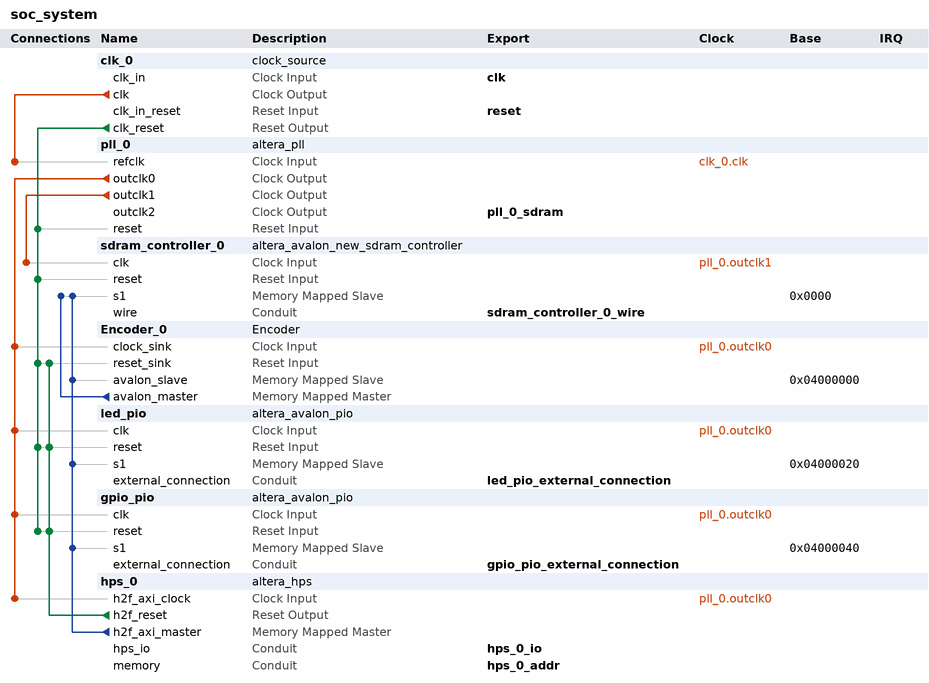
[diagram p0: system contents]
# Platform Designer (Qsys) system soc_system, Cyclone V 5CSEMA5F31C6
# Parameters at their usual value, and those the tool derives, are not listed.
package require -exact qsys 18.1
create_system soc_system
set_project_property DEVICE_FAMILY {Cyclone V}
set_project_property DEVICE 5CSEMA5F31C6

add_instance clk_0 clock_source 18.1
set_instance_parameter_value clk_0 clockFrequency 50000000

add_instance pll_0 altera_pll 18.1
set_instance_parameter_value pll_0 gui_device_speed_grade 1
set_instance_parameter_value pll_0 gui_number_of_clocks 3
set_instance_parameter_value pll_0 gui_operation_mode normal
set_instance_parameter_value pll_0 gui_output_clock_frequency0 50.0
set_instance_parameter_value pll_0 gui_output_clock_frequency1 100.0
set_instance_parameter_value pll_0 gui_output_clock_frequency2 100.0
set_instance_parameter_value pll_0 gui_phase_shift2 -3750
set_instance_parameter_value pll_0 gui_pll_mode {Integer-N PLL}
set_instance_parameter_value pll_0 gui_reference_clock_frequency 50.0
set_instance_parameter_value pll_0 gui_use_locked false

add_instance sdram_controller_0 altera_avalon_new_sdram_controller 18.1
set_instance_parameter_value sdram_controller_0 TAC 5.4
set_instance_parameter_value sdram_controller_0 TRCD 15.0
set_instance_parameter_value sdram_controller_0 TRP 15.0
set_instance_parameter_value sdram_controller_0 casLatency 3
set_instance_parameter_value sdram_controller_0 columnWidth 10
set_instance_parameter_value sdram_controller_0 dataWidth 16
set_instance_parameter_value sdram_controller_0 generateSimulationModel false
set_instance_parameter_value sdram_controller_0 model single_Micron_MT48LC4M32B2_7_chip
set_instance_parameter_value sdram_controller_0 numberOfBanks 4
set_instance_parameter_value sdram_controller_0 numberOfChipSelects 1
set_instance_parameter_value sdram_controller_0 powerUpDelay 100.0
set_instance_parameter_value sdram_controller_0 refreshPeriod 7.8125
set_instance_parameter_value sdram_controller_0 rowWidth 13

add_instance Encoder_0 Encoder 1.0

add_instance led_pio altera_avalon_pio 18.1
set_instance_parameter_value led_pio bitModifyingOutReg true
set_instance_parameter_value led_pio direction Output
set_instance_parameter_value led_pio width 10

add_instance gpio_pio altera_avalon_pio 18.1
set_instance_parameter_value gpio_pio bitModifyingOutReg true
set_instance_parameter_value gpio_pio direction Output
set_instance_parameter_value gpio_pio width 8

add_instance hps_0 altera_hps 18.1
set_instance_parameter_value hps_0 EMAC1_Mode RGMII
set_instance_parameter_value hps_0 EMAC1_PinMuxing {HPS I/O Set 0}
set_instance_parameter_value hps_0 F2SCLK_COLDRST_Enable false
set_instance_parameter_value hps_0 F2SCLK_DBGRST_Enable false
set_instance_parameter_value hps_0 F2SCLK_WARMRST_Enable false
set_instance_parameter_value hps_0 F2SINTERRUPT_Enable false
set_instance_parameter_value hps_0 F2S_Width 0
set_instance_parameter_value hps_0 FPGA_PERIPHERAL_OUTPUT_CLOCK_FREQ_EMAC0_GTX_CLK 125
set_instance_parameter_value hps_0 FPGA_PERIPHERAL_OUTPUT_CLOCK_FREQ_EMAC0_MD_CLK 2.5
set_instance_parameter_value hps_0 FPGA_PERIPHERAL_OUTPUT_CLOCK_FREQ_EMAC1_GTX_CLK 125
set_instance_parameter_value hps_0 FPGA_PERIPHERAL_OUTPUT_CLOCK_FREQ_EMAC1_MD_CLK 2.5
set_instance_parameter_value hps_0 HPS_PROTOCOL DDR3
set_instance_parameter_value hps_0 I2C0_Mode I2C
set_instance_parameter_value hps_0 I2C0_PinMuxing {HPS I/O Set 0}
set_instance_parameter_value hps_0 I2C1_Mode I2C
set_instance_parameter_value hps_0 I2C1_PinMuxing {HPS I/O Set 0}
set_instance_parameter_value hps_0 LWH2F_Enable false
set_instance_parameter_value hps_0 MEM_BANKADDR_WIDTH 3
set_instance_parameter_value hps_0 MEM_CLK_FREQ 400.0
set_instance_parameter_value hps_0 MEM_COL_ADDR_WIDTH 10
set_instance_parameter_value hps_0 MEM_DQ_WIDTH 32
set_instance_parameter_value hps_0 MEM_DRV_STR RZQ/7
set_instance_parameter_value hps_0 MEM_ROW_ADDR_WIDTH 15
set_instance_parameter_value hps_0 MEM_RTT_NOM RZQ/4
set_instance_parameter_value hps_0 MEM_RTT_WR RZQ/4
set_instance_parameter_value hps_0 MEM_TCL 11
set_instance_parameter_value hps_0 MEM_TFAW_NS 30.0
set_instance_parameter_value hps_0 MEM_TRAS_NS 35.0
set_instance_parameter_value hps_0 MEM_TRCD_NS 13.75
set_instance_parameter_value hps_0 MEM_TRFC_NS 260.0
set_instance_parameter_value hps_0 MEM_TRP_NS 13.75
set_instance_parameter_value hps_0 MEM_VENDOR Other
set_instance_parameter_value hps_0 MEM_WTCL 8
set_instance_parameter_value hps_0 QSPI_Mode {1 SS}
set_instance_parameter_value hps_0 QSPI_PinMuxing {HPS I/O Set 0}
set_instance_parameter_value hps_0 REF_CLK_FREQ 25.0
set_instance_parameter_value hps_0 S2FCLK_USER2CLK 5
set_instance_parameter_value hps_0 S2F_Width 1
set_instance_parameter_value hps_0 SDIO_Mode {4-bit Data}
set_instance_parameter_value hps_0 SDIO_PinMuxing {HPS I/O Set 0}
set_instance_parameter_value hps_0 SPIM1_Mode {Single Slave Select}
set_instance_parameter_value hps_0 SPIM1_PinMuxing {HPS I/O Set 0}
set_instance_parameter_value hps_0 STM_Enable false
set_instance_parameter_value hps_0 TIMING_BOARD_AC_SKEW 0.02
set_instance_parameter_value hps_0 TIMING_BOARD_AC_TO_CK_SKEW 0.01
set_instance_parameter_value hps_0 TIMING_BOARD_DQ_TO_DQS_SKEW 0.05
set_instance_parameter_value hps_0 TIMING_BOARD_MAX_CK_DELAY 0.03
set_instance_parameter_value hps_0 TIMING_BOARD_MAX_DQS_DELAY 0.02
set_instance_parameter_value hps_0 TIMING_BOARD_SKEW_BETWEEN_DQS 0.06
set_instance_parameter_value hps_0 TIMING_BOARD_SKEW_CKDQS_DIMM_MAX 0.12
set_instance_parameter_value hps_0 TIMING_BOARD_SKEW_CKDQS_DIMM_MIN 0.06
set_instance_parameter_value hps_0 TIMING_BOARD_SKEW_WITHIN_DQS 0.01
set_instance_parameter_value hps_0 TIMING_TDH 65
set_instance_parameter_value hps_0 TIMING_TDQSCK 255
set_instance_parameter_value hps_0 TIMING_TDQSQ 125
set_instance_parameter_value hps_0 TIMING_TDS 30
set_instance_parameter_value hps_0 TIMING_TIH 140
set_instance_parameter_value hps_0 TIMING_TIS 180
set_instance_parameter_value hps_0 TIMING_TQSH 0.4
set_instance_parameter_value hps_0 UART0_Mode {No Flow Control}
set_instance_parameter_value hps_0 UART0_PinMuxing {HPS I/O Set 0}
set_instance_parameter_value hps_0 USB1_Mode SDR
set_instance_parameter_value hps_0 USB1_PinMuxing {HPS I/O Set 0}
set_instance_parameter_value hps_0 desired_cfg_clk_mhz 100.0
set_instance_parameter_value hps_0 desired_qspi_clk_mhz 370.0

# connections
add_connection clk_0.clk pll_0.refclk clock
add_connection pll_0.outclk0 Encoder_0.clock_sink clock
add_connection pll_0.outclk0 gpio_pio.clk clock
add_connection pll_0.outclk0 hps_0.h2f_axi_clock clock
add_connection pll_0.outclk0 led_pio.clk clock
add_connection pll_0.outclk1 sdram_controller_0.clk clock
add_connection clk_0.clk_reset Encoder_0.reset_sink reset
add_connection clk_0.clk_reset gpio_pio.reset reset
add_connection clk_0.clk_reset led_pio.reset reset
add_connection clk_0.clk_reset pll_0.reset reset
add_connection clk_0.clk_reset sdram_controller_0.reset reset
add_connection hps_0.h2f_reset Encoder_0.reset_sink reset
add_connection hps_0.h2f_reset gpio_pio.reset reset
add_connection hps_0.h2f_reset led_pio.reset reset
add_connection Encoder_0.avalon_master sdram_controller_0.s1 avalon
set_connection_parameter_value Encoder_0.avalon_master/sdram_controller_0.s1 baseAddress 0x0000
add_connection hps_0.h2f_axi_master Encoder_0.avalon_slave avalon
set_connection_parameter_value hps_0.h2f_axi_master/Encoder_0.avalon_slave baseAddress 0x04000000
add_connection hps_0.h2f_axi_master gpio_pio.s1 avalon
set_connection_parameter_value hps_0.h2f_axi_master/gpio_pio.s1 baseAddress 0x04000040
add_connection hps_0.h2f_axi_master led_pio.s1 avalon
set_connection_parameter_value hps_0.h2f_axi_master/led_pio.s1 baseAddress 0x04000020
add_connection hps_0.h2f_axi_master sdram_controller_0.s1 avalon
set_connection_parameter_value hps_0.h2f_axi_master/sdram_controller_0.s1 baseAddress 0x0000

# exported interfaces
add_interface clk clock sink
set_interface_property clk EXPORT_OF clk_0.clk_in
add_interface gpio_pio_external_connection conduit end
set_interface_property gpio_pio_external_connection EXPORT_OF gpio_pio.external_connection
add_interface hps_0_addr conduit end
set_interface_property hps_0_addr EXPORT_OF hps_0.memory
add_interface hps_0_io conduit end
set_interface_property hps_0_io EXPORT_OF hps_0.hps_io
add_interface led_pio_external_connection conduit end
set_interface_property led_pio_external_connection EXPORT_OF led_pio.external_connection
add_interface pll_0_sdram clock source
set_interface_property pll_0_sdram EXPORT_OF pll_0.outclk2
add_interface reset reset sink
set_interface_property reset EXPORT_OF clk_0.clk_in_reset
add_interface sdram_controller_0_wire conduit end
set_interface_property sdram_controller_0_wire EXPORT_OF sdram_controller_0.wire

set_interconnect_requirement {$system} qsys_mm.clockCrossingAdapter HANDSHAKE
set_interconnect_requirement {$system} qsys_mm.enableEccProtection FALSE
set_interconnect_requirement {$system} qsys_mm.insertDefaultSlave FALSE
set_interconnect_requirement {$system} qsys_mm.maxAdditionalLatency 1

save_system soc_system.qsys
